# Altium schematic sheet [01] - COVER PAGE.SchDoc
size A3; DocumentNumber: 1; SheetNumber: 1; SheetTotal: 12
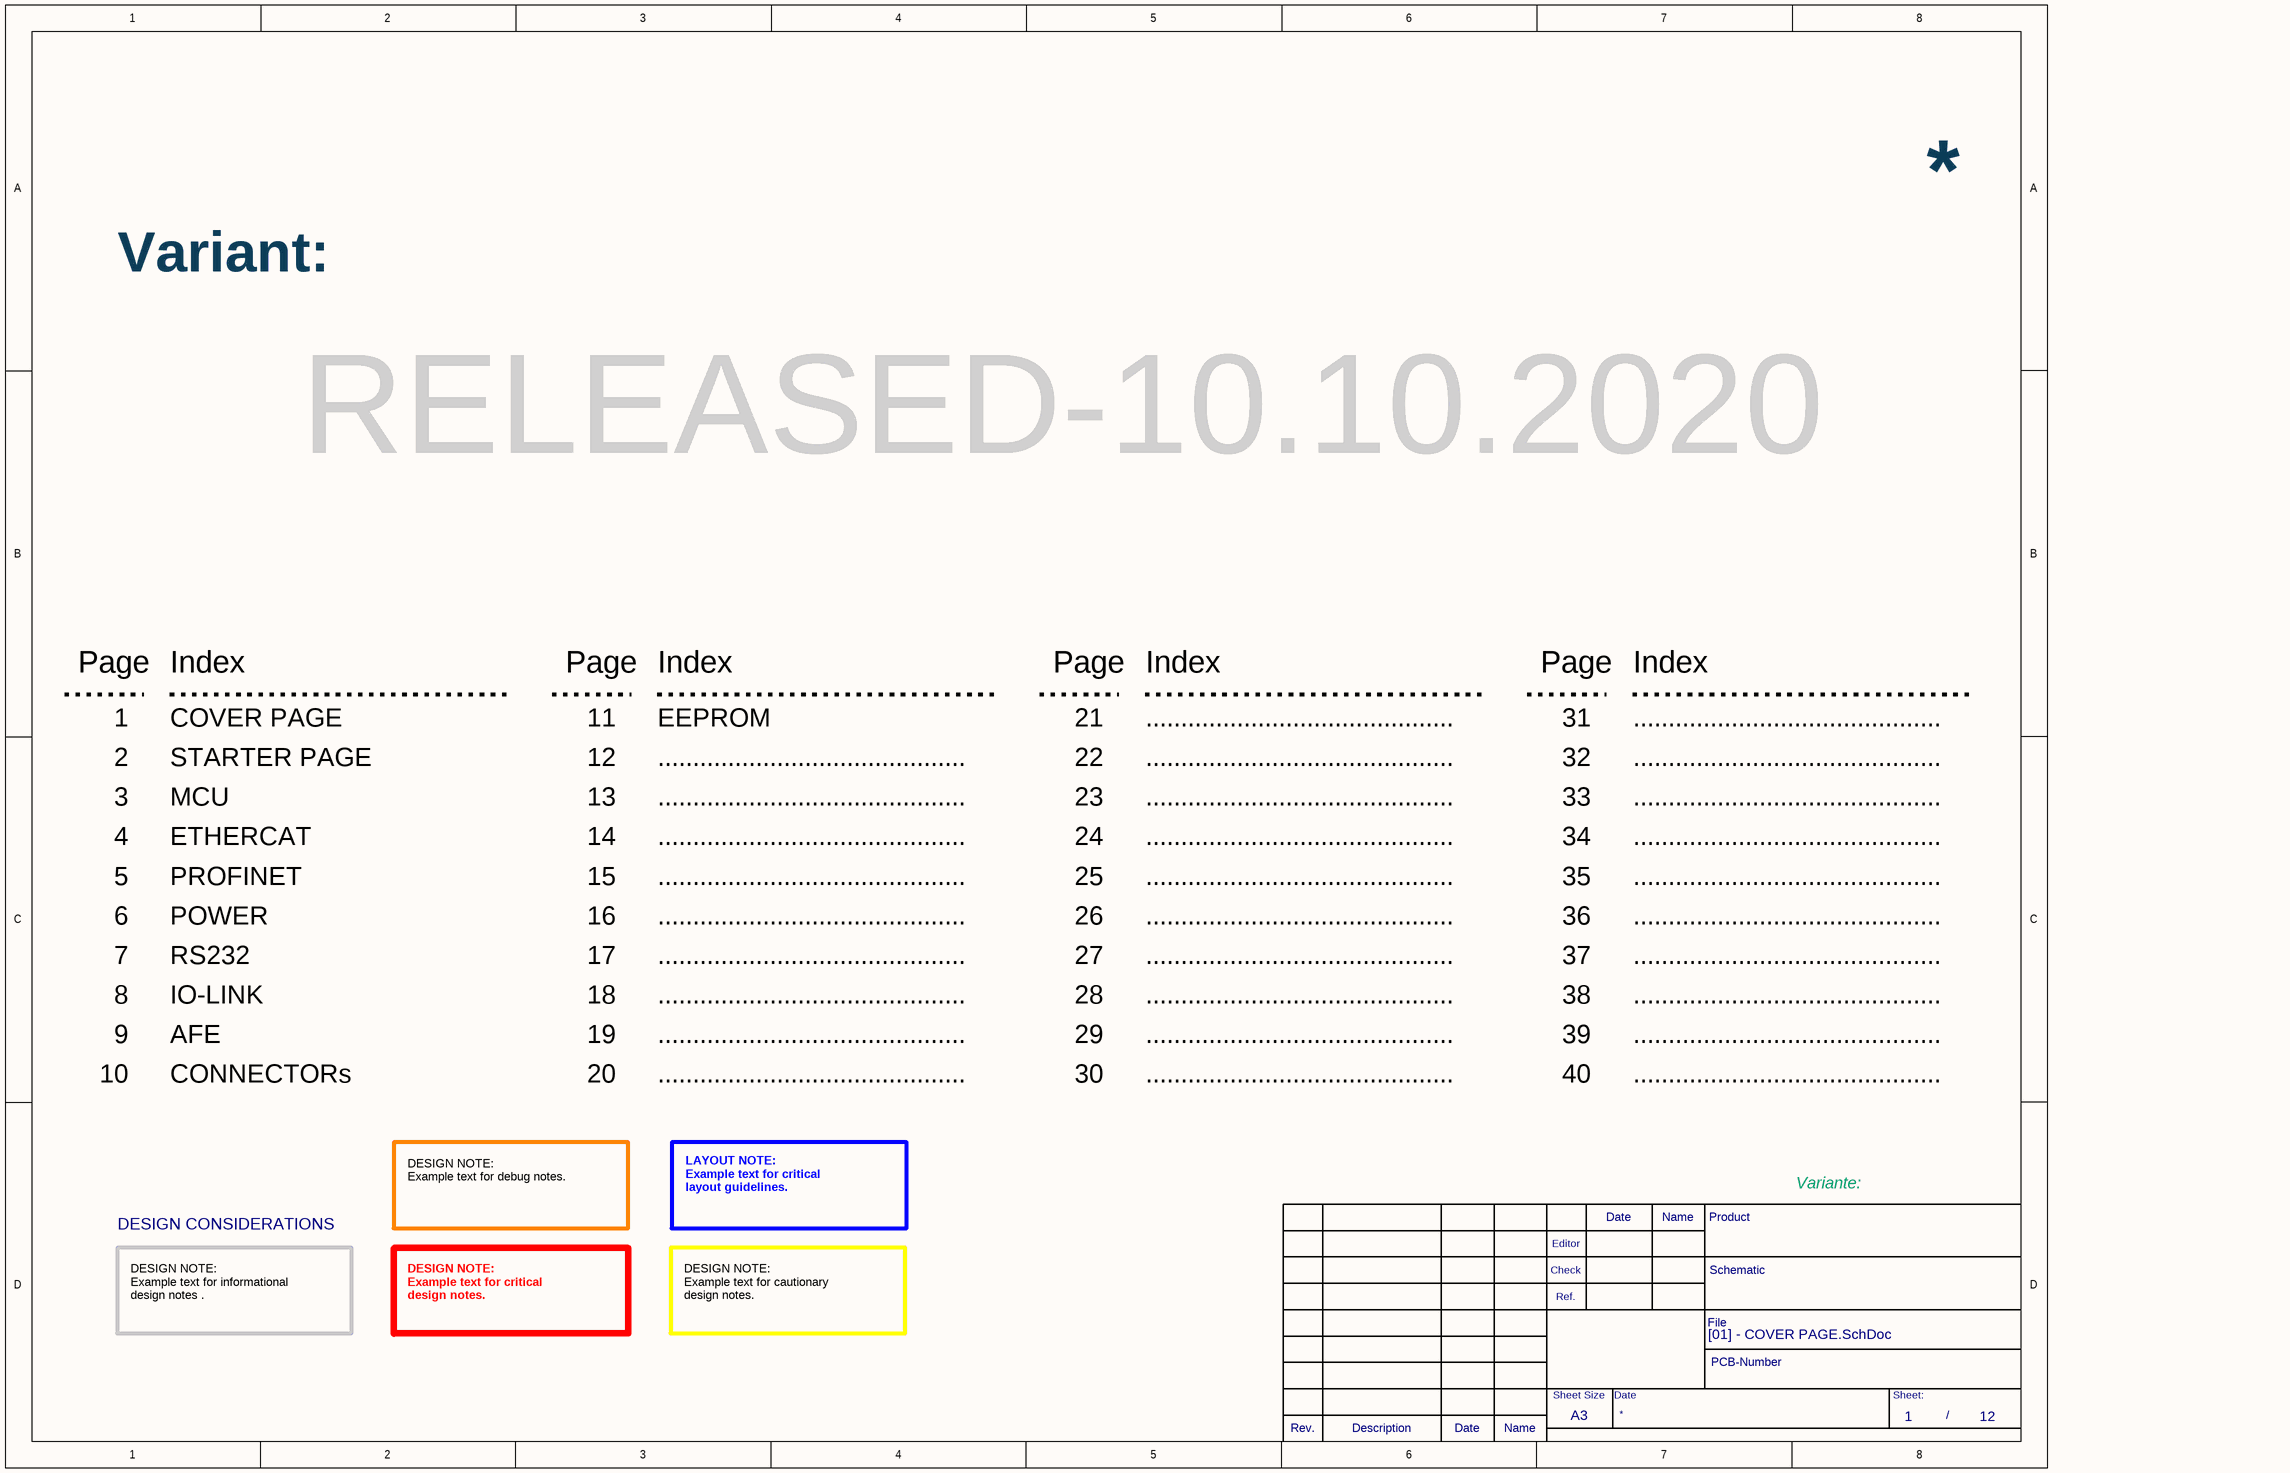
[diagram p0: [01] - COVER PAGE.SchDoc]

## Notes on the sheet
- Variant:
- RELEASED-10.10.2020
- Page
- Index
- 1
- 2
- COVER PAGE
- STARTER PAGE
- 11
- 12
- EEPROM
- ............................................
- 21
- 22
- 31
- 32
- 3
- MCU
- 13
- 23
- 33
- 4
- 5
- ETHERCAT
- PROFINET
- 14
- 15
- 24
- 25
- 34
- 35
- 6
- 7
- POWER
- RS232
- 16
- 17
- 26
- 27
- 36
- 37
- 8
- IO-LINK
- 18
- 28
- 38
- 9
- 10
- AFE
- CONNECTORs
- 19
- 20
- 29
- 30
- 39
- 40
- DESIGN CONSIDERATIONS
- DESIGN NOTE:
  Example text for debug notes.
- LAYOUT NOTE:
  Example text for critical
  layout guidelines.
- DESIGN NOTE:
  Example text for informational
  design notes .
- DESIGN NOTE:
  Example text for critical
  design notes.
- DESIGN NOTE:
  Example text for cautionary
  design notes.
- Date
- Name
- Product
- Variante:
- Editor
- Check
- Ref.
- Schematic
- File
- PCB-Number
- Rev.
- Description
- Sheet Size
- A3
- Sheet:
- /